# Altium schematic sheet esquematico_medidorDigital.SchDoc: Medidor de distancia digital
size A4
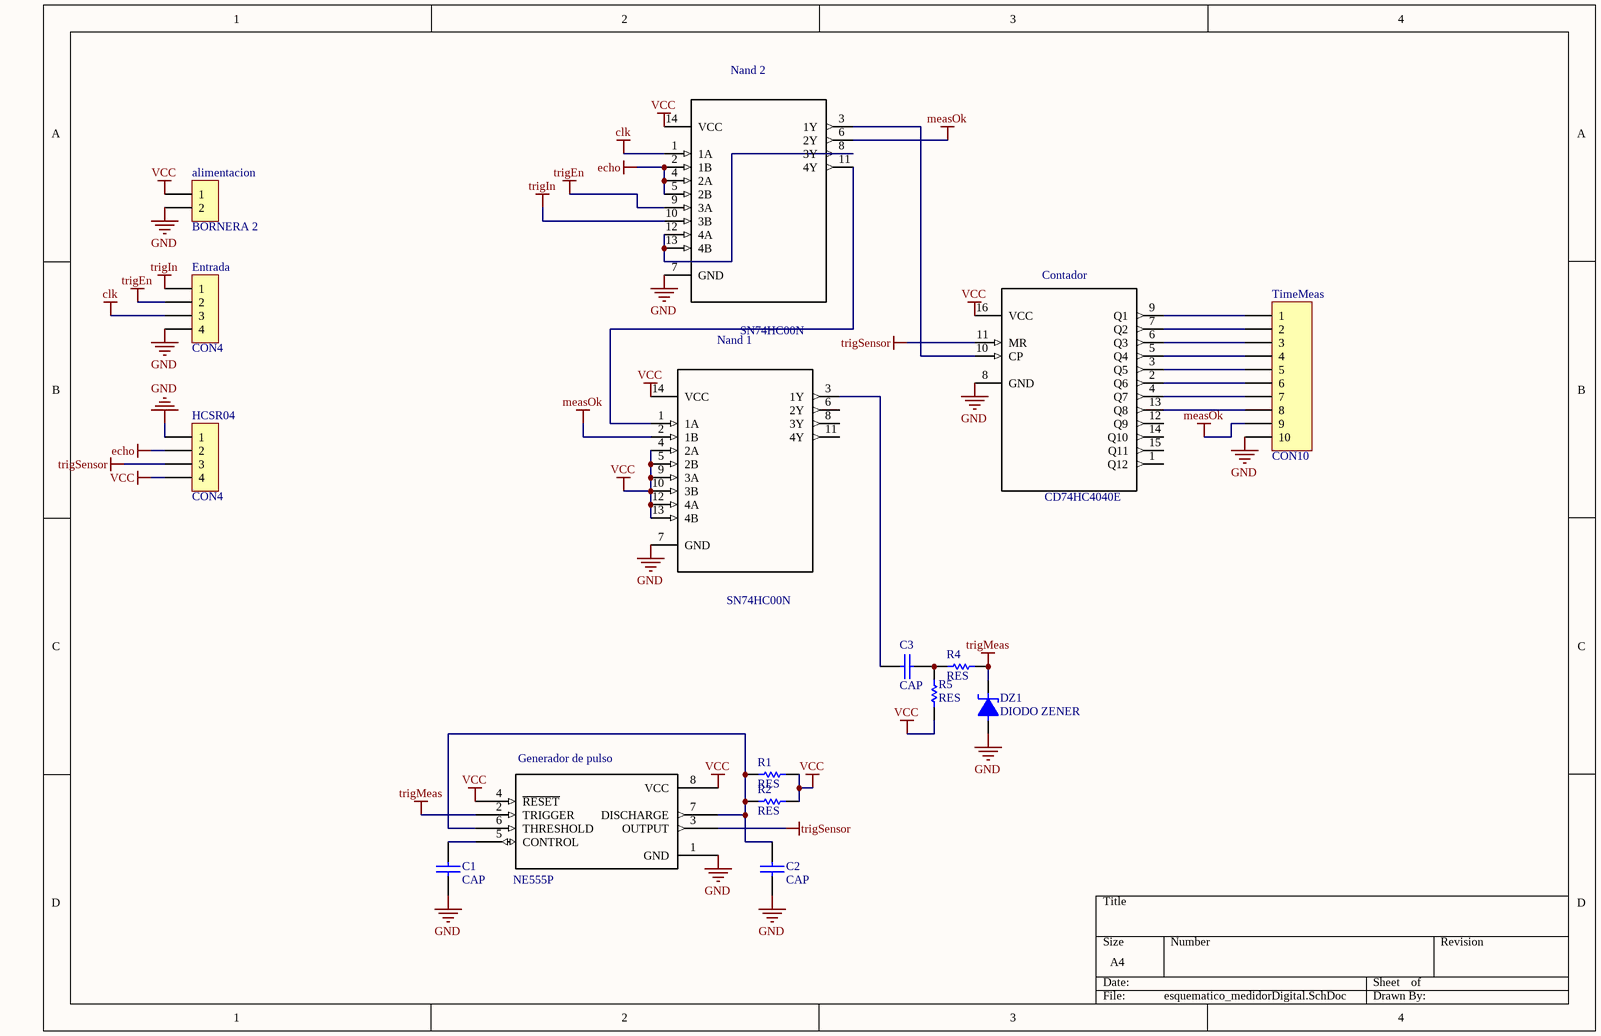
[diagram p0: esquematico_medidorDigital.SchDoc]

## Parts
alimentacion  BORNERA 2  [BORNERA2]
C1  CAP  [CAP200]
C2  CAP  [CAP200]
C3  CAP  [CAP200]
Contador  CD74HC4040E  [DIP254P762X508-16]
DZ1  DIODO ZENER  [DO41]
Entrada  CON4  [SIP4]
Generador_de_pulso  NE555P  [DIP1092W45P254L1016H508Q8]
HCSR04  CON4  [SIP4]
Nand_1  SN74HC00N  [DIP254P762X508-14]
Nand_2  SN74HC00N  [DIP254P762X508-14]
R1  RES  [RES400]
R2  RES  [RES400]
R4  RES  [RES400]
R5  RES  [RES400]
TimeMeas  CON10  [SIP10]

## Nets
clk: Entrada.3 Nand_2.1(1A)
echo: HCSR04.2 Nand_2.2(1B) Nand_2.4(2A) Nand_2.5(2B)
GND: alimentacion.2 C1.2 C2.2 Contador.8(GND) DZ1.1 Entrada.4 Generador_de_pulso.1(GND) HCSR04.1 Nand_1.7(GND) Nand_2.7(GND) TimeMeas.10
measOk: Nand_1.2(1B) Nand_2.6(2Y) TimeMeas.9
trigEn: Entrada.2 Nand_2.9(3A)
trigIn: Entrada.1 Nand_2.10(3B)
trigMeas: DZ1.2 Generador_de_pulso.2(TRIGGER) R4.1
trigSensor: Contador.11(MR) Generador_de_pulso.3(OUTPUT) HCSR04.3
VCC: alimentacion.1 Contador.16(VCC) Generador_de_pulso.4(~{RESET}) Generador_de_pulso.8(VCC) HCSR04.4 Nand_1.4(2A) Nand_1.5(2B) Nand_1.9(3A) Nand_1.10(3B) Nand_1.12(4A) Nand_1.13(4B) Nand_1.14(VCC) Nand_2.14(VCC) R1.2 R2.2 R5.1
NetC1_1: C1.1 Generador_de_pulso.5(CONTROL)
NetC2_1: C2.1 Generador_de_pulso.6(THRESHOLD) Generador_de_pulso.7(DISCHARGE) R1.1 R2.1
NetC3_1: C3.1 Nand_1.3(1Y)
NetC3_2: C3.2 R4.2 R5.2
NetContador_2: Contador.2(Q6) TimeMeas.6
NetContador_3: Contador.3(Q5) TimeMeas.5
NetContador_4: Contador.4(Q7) TimeMeas.7
NetContador_5: Contador.5(Q4) TimeMeas.4
NetContador_6: Contador.6(Q3) TimeMeas.3
NetContador_7: Contador.7(Q2) TimeMeas.2
NetContador_9: Contador.9(Q1) TimeMeas.1
NetContador_10: Contador.10(CP) Nand_2.3(1Y)
NetContador_13: Contador.13(Q8) TimeMeas.8
NetNand_1_1: Nand_1.1(1A) Nand_2.11(4Y)
NetNand_2_8: Nand_2.8(3Y) Nand_2.12(4A) Nand_2.13(4B)

Not connected (* = marked no-connect by the designer): Contador 1(Q12) 12(Q9) 14(Q10) 15(Q11); Nand_1 6(2Y) 8(3Y) 11(4Y)

## Library data of the parts
Contador = CD74HC4040E: High Speed CMOS Logic 12-Stage Binary Counter 16-PDIP -55 to 125; MF: Texas Instruments; Package: PDIP-16 Texas Instruments; MP: CD74HC4040E; Price: None; SnapEDA_Link: https://www.snapeda.com/parts/CD74HC4040E/Texas%20Instruments/view-part/?ref=snap; Availability: Unavailable; Value: *
Generador_de_pulso = NE555P: MF: Texas Instruments; Package: PDIP-8 STMicroelectronics; Digi-Key_Part_Number: 296-1411-5-ND; MP: NE555P; SnapEDA_Link: https://www.snapeda.com/parts/NE555P/Texas%20Instruments/view-part/?ref=snap; Digi-Key_Purchase_URL: https://www.digikey.com.ar/product-detail/en/texas-instruments/NE555P/296-1411-5-ND/277057?utm_source=snapeda&utm_medium=aggregator&utm_campaign=symbol; Value: *
Nand_1 Nand_2 = SN74HC00N: NAND Gate 4-Element 2-IN CMOS 14-Pin PDIP NAND Gate 4-Element 2-IN CMOS 14-Pin PDIP NAND Gate 4-Element 2-IN CMOS 14-...; MF: Texas Instruments; Package: DIP-14 Texas Instruments; MP: SN74HC00N; Price: None; SnapEDA_Link: https://www.snapeda.com/parts/SN74HC00N/Texas%20Instruments/view-part/?ref=snap; Availability: Unavailable; Value: *